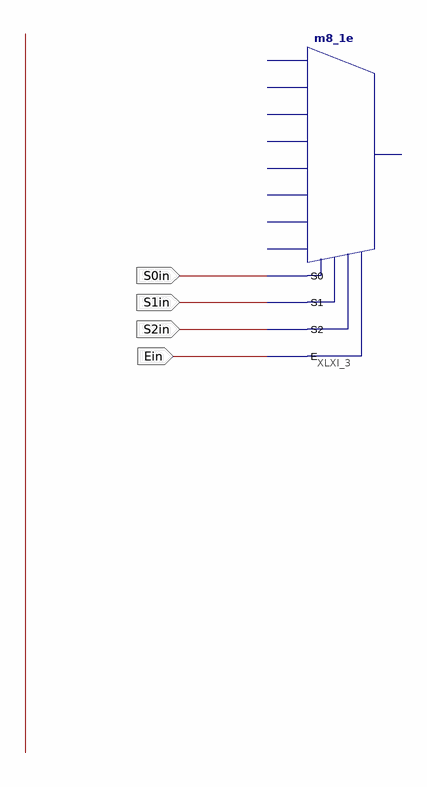
[diagram p0: schematic sheet 1]
// Xilinx ISE schematic lab7_experiment10.sch (spartan3e) as structural Verilog: 1 symbols, 4 ports
module lab7_experiment10 (
  input  S0in,
  input  S1in,
  input  S2in,
  input  Ein
);

  m8_1e XLXI_3 (.E(Ein), .S0(S0in), .S1(S1in), .S2(S2in));  // open: D0, D1, D2, D3, D4, D5, D6, D7, O
endmodule
